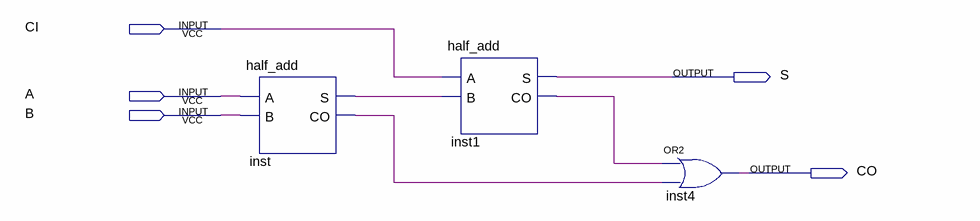
[diagram p0: schematic sheet]
// Quartus schematic full_add.bdf as structural Verilog: 3 symbols, 5 pins
module full_add (
  input  CI,
  input  A,
  input  B,
  output S,
  output CO
);

  wire inst1_co, inst_co, inst_s;

  half_add inst (.A(A), .B(B), .S(inst_s), .CO(inst_co));
  half_add inst1 (.A(CI), .B(inst_s), .S(S), .CO(inst1_co));
  or inst4 (CO, inst1_co, inst_co);
endmodule
